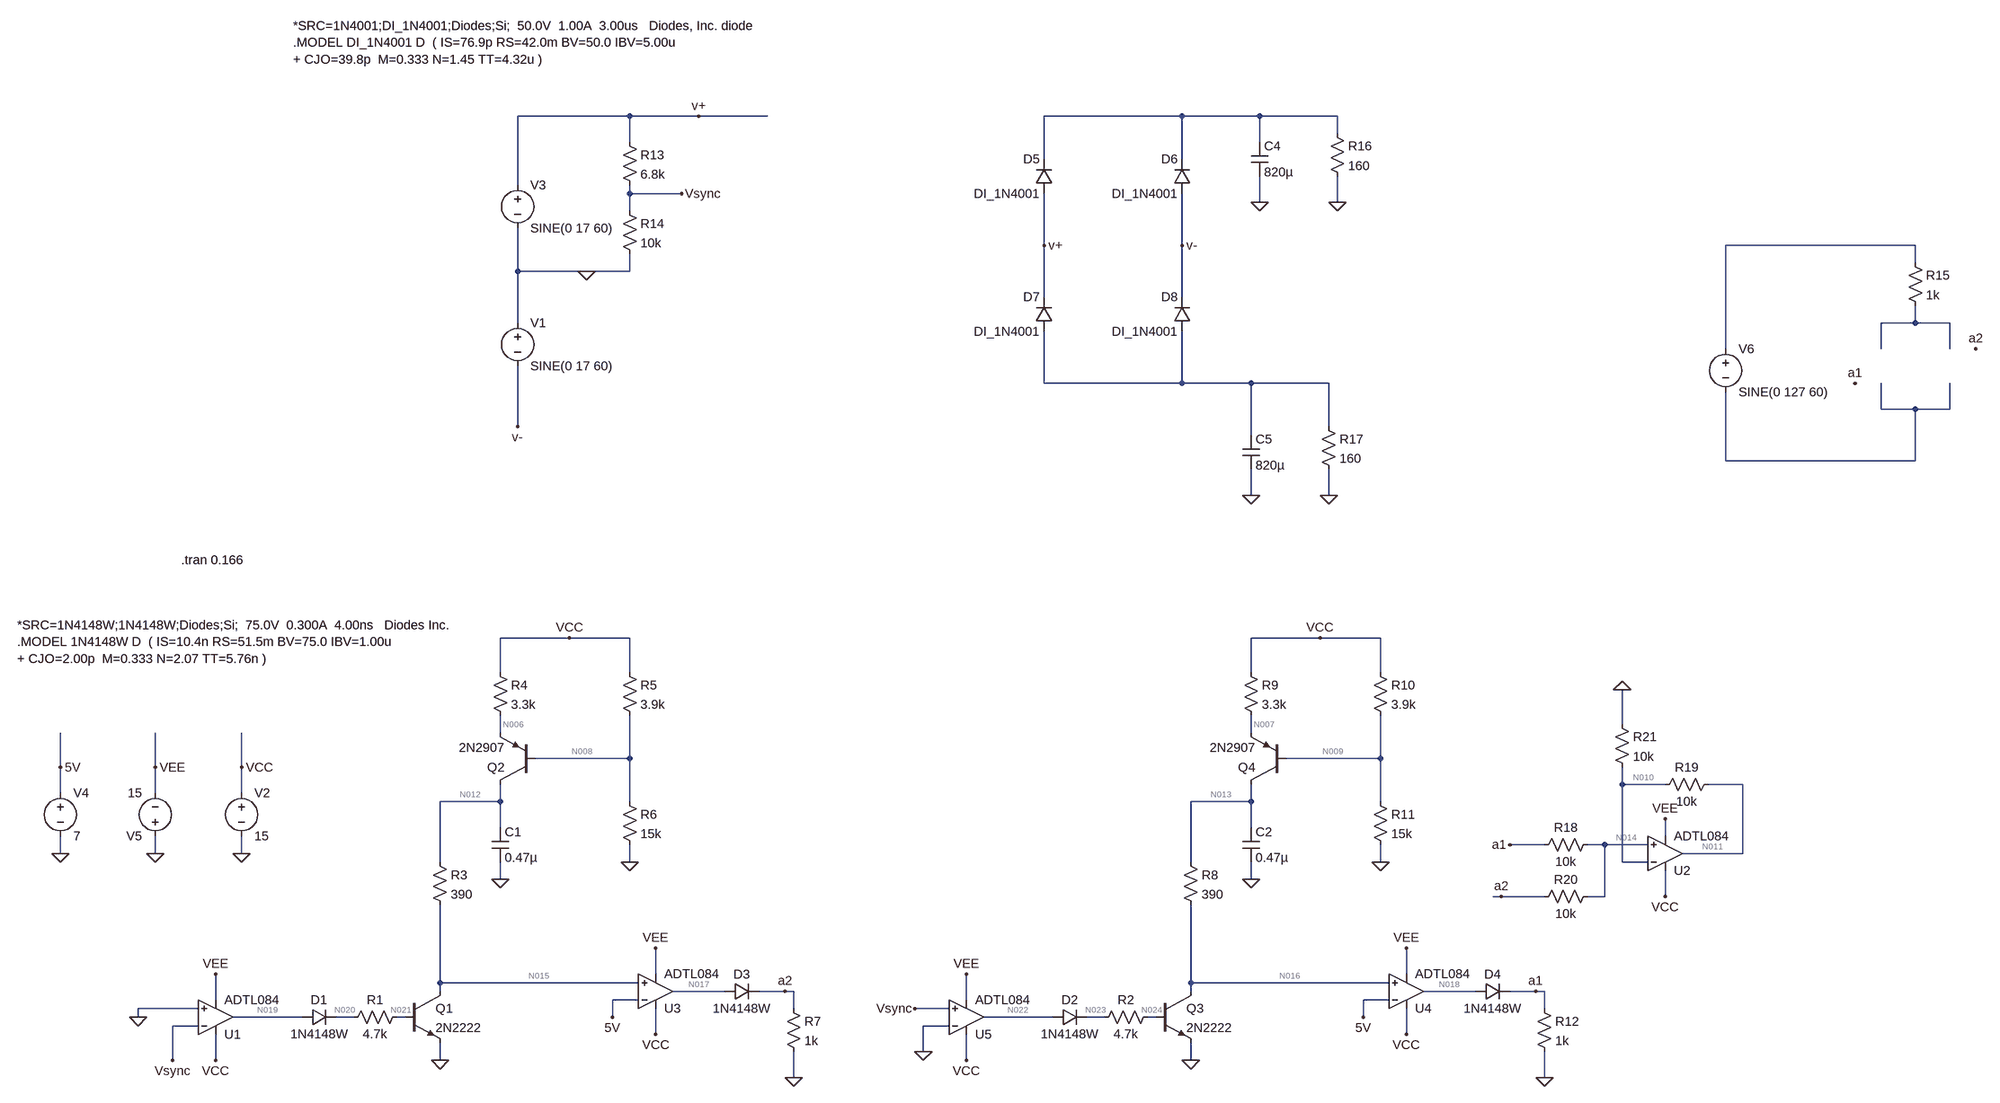
[diagram p0: schematic TDC_tiristores.asc]
TDC_tiristores.asc, the LTspice schematic file:
Version 4.1
SHEET 1 3504 1388
WIRE 944 -1568 736 -1568
WIRE 1072 -1568 944 -1568
WIRE 1200 -1568 1072 -1568
WIRE 2000 -1568 1744 -1568
WIRE 2144 -1568 2000 -1568
WIRE 2288 -1568 2144 -1568
WIRE 2288 -1536 2288 -1568
WIRE 944 -1520 944 -1568
WIRE 2144 -1520 2144 -1568
WIRE 1744 -1488 1744 -1568
WIRE 2000 -1488 2000 -1568
WIRE 736 -1440 736 -1568
WIRE 944 -1424 944 -1440
WIRE 1040 -1424 944 -1424
WIRE 2144 -1408 2144 -1456
WIRE 2288 -1408 2288 -1456
WIRE 944 -1392 944 -1424
WIRE 1744 -1328 1744 -1424
WIRE 2000 -1328 2000 -1424
WIRE 3360 -1328 3008 -1328
WIRE 3360 -1296 3360 -1328
WIRE 736 -1280 736 -1360
WIRE 864 -1280 736 -1280
WIRE 944 -1280 944 -1312
WIRE 944 -1280 864 -1280
WIRE 1744 -1232 1744 -1328
WIRE 2000 -1232 2000 -1328
WIRE 736 -1184 736 -1280
WIRE 3360 -1184 3360 -1216
WIRE 3360 -1184 3296 -1184
WIRE 3424 -1184 3360 -1184
WIRE 3008 -1136 3008 -1328
WIRE 3296 -1136 3296 -1184
WIRE 3424 -1136 3424 -1184
WIRE 1744 -1072 1744 -1168
WIRE 2000 -1072 2000 -1168
WIRE 2000 -1072 1744 -1072
WIRE 2128 -1072 2000 -1072
WIRE 2272 -1072 2128 -1072
WIRE 3296 -1024 3296 -1072
WIRE 3360 -1024 3296 -1024
WIRE 3424 -1024 3424 -1072
WIRE 3424 -1024 3360 -1024
WIRE 736 -992 736 -1104
WIRE 2272 -992 2272 -1072
WIRE 2128 -976 2128 -1072
WIRE 3008 -928 3008 -1056
WIRE 3360 -928 3360 -1024
WIRE 3360 -928 3008 -928
WIRE 2128 -864 2128 -912
WIRE 2272 -864 2272 -912
WIRE 832 -576 704 -576
WIRE 944 -576 832 -576
WIRE 2256 -576 2128 -576
WIRE 2368 -576 2256 -576
WIRE 704 -512 704 -576
WIRE 944 -512 944 -576
WIRE 2128 -512 2128 -576
WIRE 2368 -512 2368 -576
WIRE 2816 -416 2816 -480
WIRE 704 -400 704 -432
WIRE 2128 -400 2128 -432
WIRE 944 -352 944 -432
WIRE 944 -352 768 -352
WIRE 2368 -352 2368 -432
WIRE 2368 -352 2192 -352
WIRE -112 -336 -112 -400
WIRE 64 -336 64 -400
WIRE 224 -336 224 -400
WIRE 2816 -304 2816 -336
WIRE 2896 -304 2816 -304
WIRE 3040 -304 2976 -304
WIRE -112 -288 -112 -336
WIRE 64 -288 64 -336
WIRE 224 -288 224 -336
WIRE 704 -272 704 -304
WIRE 704 -272 592 -272
WIRE 944 -272 944 -352
WIRE 2128 -272 2128 -304
WIRE 2128 -272 2016 -272
WIRE 2368 -272 2368 -352
WIRE 704 -224 704 -272
WIRE 2128 -224 2128 -272
WIRE 2896 -208 2896 -240
WIRE 2672 -192 2608 -192
WIRE 2784 -192 2752 -192
WIRE 2864 -192 2784 -192
WIRE -112 -176 -112 -208
WIRE 64 -176 64 -208
WIRE 224 -176 224 -208
WIRE 3040 -176 3040 -304
WIRE 3040 -176 2928 -176
WIRE 592 -160 592 -272
WIRE 944 -160 944 -192
WIRE 2016 -160 2016 -272
WIRE 2368 -160 2368 -192
WIRE 2816 -160 2816 -304
WIRE 2864 -160 2816 -160
WIRE 704 -128 704 -160
WIRE 2128 -128 2128 -160
WIRE 2592 -96 2576 -96
WIRE 2672 -96 2592 -96
WIRE 2784 -96 2784 -192
WIRE 2784 -96 2752 -96
WIRE 2896 -96 2896 -144
WIRE 992 48 992 0
WIRE 2416 48 2416 0
WIRE 592 64 592 -80
WIRE 960 64 592 64
WIRE 2016 64 2016 -80
WIRE 2384 64 2016 64
WIRE 592 80 592 64
WIRE 1120 80 1024 80
WIRE 1232 80 1184 80
WIRE 1248 80 1232 80
WIRE 2016 80 2016 64
WIRE 2544 80 2448 80
WIRE 2656 80 2608 80
WIRE 2672 80 2656 80
WIRE 176 96 176 48
WIRE 960 96 912 96
WIRE 1600 96 1600 48
WIRE 2384 96 2336 96
WIRE 144 112 32 112
WIRE 1248 112 1248 80
WIRE 1568 112 1504 112
WIRE 2672 112 2672 80
WIRE 32 128 32 112
WIRE 336 128 208 128
WIRE 432 128 400 128
WIRE 528 128 512 128
WIRE 912 128 912 96
WIRE 1760 128 1632 128
WIRE 1856 128 1824 128
WIRE 1952 128 1936 128
WIRE 2336 128 2336 96
WIRE 144 144 96 144
WIRE 1568 144 1520 144
WIRE 992 160 992 112
WIRE 2416 160 2416 112
WIRE 1520 192 1520 144
WIRE 96 208 96 144
WIRE 176 208 176 160
WIRE 592 208 592 176
WIRE 1600 208 1600 160
WIRE 2016 208 2016 176
WIRE 1248 240 1248 192
WIRE 2672 240 2672 192
FLAG 224 -176 0
FLAG 64 -176 0
FLAG -112 -176 0
FLAG 224 -336 VCC
FLAG -112 -336 5V
FLAG 64 -336 VEE
FLAG 176 208 VCC
FLAG 32 128 0
FLAG 176 48 VEE
FLAG 592 208 0
FLAG 944 -160 0
FLAG 992 160 VCC
FLAG 992 0 VEE
FLAG 912 128 5V
FLAG 1248 240 0
FLAG 704 -128 0
FLAG 1600 208 VCC
FLAG 1600 48 VEE
FLAG 2016 208 0
FLAG 2368 -160 0
FLAG 2416 160 VCC
FLAG 2416 0 VEE
FLAG 2336 128 5V
FLAG 2672 240 0
FLAG 2128 -128 0
FLAG 1504 112 Vsync
FLAG 1520 192 0
FLAG 832 -576 VCC
FLAG 2256 -576 VCC
FLAG 1040 -1424 Vsync
FLAG 96 208 Vsync
FLAG 864 -1280 0
FLAG 1072 -1568 v+
FLAG 736 -992 v-
FLAG 2144 -1408 0
FLAG 2288 -1408 0
FLAG 2128 -864 0
FLAG 2272 -864 0
FLAG 1744 -1328 v+
FLAG 2000 -1328 v-
FLAG 2656 80 a1
FLAG 1232 80 a2
FLAG 3248 -1072 a1
FLAG 3472 -1136 a2
FLAG 2608 -192 a1
FLAG 2592 -96 a2
FLAG 2896 -240 VEE
FLAG 2896 -96 VCC
FLAG 2816 -480 0
SYMBOL OpAmps\\ADTL084 176 192 M180
SYMATTR InstName U1
SYMBOL voltage 224 -304 R0
WINDOW 123 0 0 Left 0
WINDOW 39 0 0 Left 0
SYMATTR InstName V2
SYMATTR Value 15
SYMBOL voltage -112 -304 R0
WINDOW 123 0 0 Left 0
WINDOW 39 0 0 Left 0
SYMATTR InstName V4
SYMATTR Value 7
SYMBOL diode 336 144 R270
WINDOW 0 32 32 VTop 2
WINDOW 3 0 32 VBottom 2
SYMATTR InstName D1
SYMATTR Value 1N4148W
SYMBOL res 528 112 R90
WINDOW 0 0 56 VBottom 2
WINDOW 3 32 56 VTop 2
SYMATTR InstName R1
SYMATTR Value 4.7k
SYMBOL npn 528 80 R0
SYMATTR InstName Q1
SYMATTR Value 2N2222
SYMBOL res 576 -176 R0
SYMATTR InstName R3
SYMATTR Value 390
SYMBOL pnp 768 -304 R180
SYMATTR InstName Q2
SYMATTR Value 2N2907
SYMBOL res 688 -528 R0
SYMATTR InstName R4
SYMATTR Value 3.3k
SYMBOL res 928 -528 R0
SYMATTR InstName R5
SYMATTR Value 3.9k
SYMBOL res 928 -288 R0
SYMATTR InstName R6
SYMATTR Value 15k
SYMBOL OpAmps\\ADTL084 992 144 M180
SYMATTR InstName U3
SYMBOL diode 1120 96 R270
WINDOW 0 32 32 VTop 2
WINDOW 3 0 32 VBottom 2
SYMATTR InstName D3
SYMATTR Value 1N4148W
SYMBOL res 1232 96 R0
SYMATTR InstName R7
SYMATTR Value 1k
SYMBOL cap 688 -224 R0
SYMATTR InstName C1
SYMATTR Value 0.47µ
SYMBOL diode 1760 144 R270
WINDOW 0 32 32 VTop 2
WINDOW 3 0 32 VBottom 2
SYMATTR InstName D2
SYMATTR Value 1N4148W
SYMBOL res 1952 112 R90
WINDOW 0 0 56 VBottom 2
WINDOW 3 32 56 VTop 2
SYMATTR InstName R2
SYMATTR Value 4.7k
SYMBOL npn 1952 80 R0
SYMATTR InstName Q3
SYMATTR Value 2N2222
SYMBOL res 2000 -176 R0
SYMATTR InstName R8
SYMATTR Value 390
SYMBOL pnp 2192 -304 R180
SYMATTR InstName Q4
SYMATTR Value 2N2907
SYMBOL res 2112 -528 R0
SYMATTR InstName R9
SYMATTR Value 3.3k
SYMBOL res 2352 -528 R0
SYMATTR InstName R10
SYMATTR Value 3.9k
SYMBOL res 2352 -288 R0
SYMATTR InstName R11
SYMATTR Value 15k
SYMBOL OpAmps\\ADTL084 2416 144 M180
SYMATTR InstName U4
SYMBOL diode 2544 96 R270
WINDOW 0 32 32 VTop 2
WINDOW 3 0 32 VBottom 2
SYMATTR InstName D4
SYMATTR Value 1N4148W
SYMBOL res 2656 96 R0
SYMATTR InstName R12
SYMATTR Value 1k
SYMBOL cap 2112 -224 R0
SYMATTR InstName C2
SYMATTR Value 0.47µ
SYMBOL OpAmps\\ADTL084 1600 192 M180
SYMATTR InstName U5
SYMBOL voltage 64 -192 R180
WINDOW 123 0 0 Left 0
WINDOW 39 0 0 Left 0
SYMATTR InstName V5
SYMATTR Value 15
SYMBOL voltage 736 -1456 R0
WINDOW 123 0 0 Left 0
WINDOW 39 0 0 Left 0
SYMATTR InstName V3
SYMATTR Value SINE(0 17 60)
SYMBOL res 928 -1536 R0
SYMATTR InstName R13
SYMATTR Value 6.8k
SYMBOL res 928 -1408 R0
SYMATTR InstName R14
SYMATTR Value 10k
SYMBOL voltage 736 -1200 R0
WINDOW 123 0 0 Left 0
WINDOW 39 0 0 Left 0
SYMATTR InstName V1
SYMATTR Value SINE(0 17 60)
SYMBOL diode 1760 -1424 R180
WINDOW 0 24 64 Left 2
WINDOW 3 24 0 Left 2
SYMATTR InstName D5
SYMATTR Value DI_1N4001
SYMBOL diode 2016 -1424 R180
WINDOW 0 24 64 Left 2
WINDOW 3 24 0 Left 2
SYMATTR InstName D6
SYMATTR Value DI_1N4001
SYMBOL diode 1760 -1168 R180
WINDOW 0 24 64 Left 2
WINDOW 3 24 0 Left 2
SYMATTR InstName D7
SYMATTR Value DI_1N4001
SYMBOL diode 2016 -1168 R180
WINDOW 0 24 64 Left 2
WINDOW 3 24 0 Left 2
SYMATTR InstName D8
SYMATTR Value DI_1N4001
SYMBOL cap 2128 -1520 R0
SYMATTR InstName C4
SYMATTR Value 820µ
SYMBOL res 2272 -1552 R0
SYMATTR InstName R16
SYMATTR Value 160
SYMBOL cap 2112 -976 R0
SYMATTR InstName C5
SYMATTR Value 820µ
SYMBOL res 2256 -1008 R0
SYMATTR InstName R17
SYMATTR Value 160
SYMBOL voltage 3008 -1152 R0
WINDOW 123 0 0 Left 0
WINDOW 39 0 0 Left 0
SYMATTR InstName V6
SYMATTR Value SINE(0 127 60)
SYMBOL res 3344 -1312 R0
SYMATTR InstName R15
SYMATTR Value 1k
SYMBOL OpAmps\\ADTL084 2896 -112 M180
SYMATTR InstName U2
SYMBOL res 2768 -208 R90
WINDOW 0 0 56 VBottom 2
WINDOW 3 32 56 VTop 2
SYMATTR InstName R18
SYMATTR Value 10k
SYMBOL res 2992 -320 R90
WINDOW 0 0 56 VBottom 2
WINDOW 3 32 56 VTop 2
SYMATTR InstName R19
SYMATTR Value 10k
SYMBOL res 2768 -112 R90
WINDOW 0 0 56 VBottom 2
WINDOW 3 32 56 VTop 2
SYMATTR InstName R20
SYMATTR Value 10k
SYMBOL res 2800 -432 R0
SYMATTR InstName R21
SYMATTR Value 10k
TEXT -192 -600 Left 2 !*SRC=1N4148W;1N4148W;Diodes;Si;  75.0V  0.300A  4.00ns   Diodes Inc. \n.MODEL 1N4148W D  ( IS=10.4n RS=51.5m BV=75.0 IBV=1.00u\n+ CJO=2.00p  M=0.333 N=2.07 TT=5.76n )
TEXT 112 -744 Left 2 !.tran 0.166
TEXT 320 -1736 Left 2 !*SRC=1N4001;DI_1N4001;Diodes;Si;  50.0V  1.00A  3.00us   Diodes, Inc. diode\n.MODEL DI_1N4001 D  ( IS=76.9p RS=42.0m BV=50.0 IBV=5.00u\n+ CJO=39.8p  M=0.333 N=1.45 TT=4.32u )

The netlist it stands for:
* TDC_tiristores.asc
X§U1 0 Vsync VCC VEE N019 ADTL084  ; pins In+ In- V+ V- OUT
V2 VCC 0 15
V4 5V 0 7
D1 N019 N020 1N4148W
R1 N021 N020 4.7k
Q1 N015 N021 0 0 2N2222
R3 N012 N015 390
Q2 N012 N008 N006 0 2N2907
R4 VCC N006 3.3k
R5 VCC N008 3.9k
R6 N008 0 15k
X§U3 N015 5V VCC VEE N017 ADTL084  ; pins In+ In- V+ V- OUT
D3 N017 a2 1N4148W
R7 a2 0 1k
C1 N012 0 0.47µ
D2 N022 N023 1N4148W
R2 N024 N023 4.7k
Q3 N016 N024 0 0 2N2222
R8 N013 N016 390
Q4 N013 N009 N007 0 2N2907
R9 VCC N007 3.3k
R10 VCC N009 3.9k
R11 N009 0 15k
X§U4 N016 5V VCC VEE N018 ADTL084  ; pins In+ In- V+ V- OUT
D4 N018 a1 1N4148W
R12 a1 0 1k
C2 N013 0 0.47µ
X§U5 Vsync 0 VCC VEE N022 ADTL084  ; pins In+ In- V+ V- OUT
V5 0 VEE 15
V3 v+ 0 SINE(0 17 60)
R13 v+ Vsync 6.8k
R14 Vsync 0 10k
V1 0 v- SINE(0 17 60)
D5 v+ N001 DI_1N4001
D6 v- N001 DI_1N4001
D7 N004 v+ DI_1N4001
D8 N004 v- DI_1N4001
C4 N001 0 820µ
R16 N001 0 160
C5 N004 0 820µ
R17 N004 0 160
V6 N002 N005 SINE(0 127 60)
R15 N002 N003 1k
X§U2 N014 N010 VCC VEE N011 ADTL084  ; pins In+ In- V+ V- OUT
R18 N014 a1 10k
R19 N011 N010 10k
R20 N014 a2 10k
R21 0 N010 10k
.model D D
.lib standard.dio
.model NPN NPN
.model PNP PNP
.lib standard.bjt
*SRC=1N4148W;1N4148W;Diodes;Si;  75.0V  0.300A  4.00ns   Diodes Inc.
.MODEL 1N4148W D  ( IS=10.4n RS=51.5m BV=75.0 IBV=1.00u
+ CJO=2.00p  M=0.333 N=2.07 TT=5.76n )
.tran 0.166
*SRC=1N4001;DI_1N4001;Diodes;Si;  50.0V  1.00A  3.00us   Diodes, Inc. diode
.MODEL DI_1N4001 D  ( IS=76.9p RS=42.0m BV=50.0 IBV=5.00u
+ CJO=39.8p  M=0.333 N=1.45 TT=4.32u )
.lib ADTL084.lib
.backanno
.end

* Results of the author's LTspice run, read from the files saved beside the schematic
* Operating Point, zero values left out:
*   V(5v) = 7 V
*   V(a1) = 12.61 V
*   V(a2) = 12.61 V
*   V(n006) = 13.75 V
*   V(n007) = 13.75 V
*   V(n008) = 13.08 V
*   V(n009) = 13.08 V
*   V(n010) = 7.274 V
*   V(n011) = 14.55 V
*   V(n012) = 13.74 V
*   V(n013) = 13.74 V
*   V(n014) = 12.61 V
*   V(n015) = 13.74 V
*   V(n016) = 13.74 V
*   V(n017) = 13.36 V
*   V(n018) = 13.36 V
*   V(n019) = 10.94 mV
*   V(n020) = 11.01 mV
*   V(n021) = 11.01 mV
*   V(n022) = -10.94 mV
*   V(n023) = -10.87 mV
*   V(n024) = -10.87 mV
*   V(vcc) = 15 V
*   V(vee) = -15 V
*   V(vsync) = -16.19 nV
*   I(D1) = -13.72 pA
*   I(D2) = -13.77 pA
*   I(D3) = 12.61 mA
*   I(D4) = 12.61 mA
*   I(R1) = 13.72 pA
*   I(R10) = 492.6 µA
*   I(R11) = 871.9 µA
*   I(R12) = 12.61 mA
*   I(R13) = 2.381 pA
*   I(R14) = -1.619 pA
*   I(R18) = -51.44 pA
*   I(R19) = 727.4 µA
*   I(R2) = 13.77 pA
*   I(R20) = -51.44 pA
*   I(R21) = -727.4 µA
*   I(R3) = 125.7 pA
*   I(R4) = 379.3 µA
*   I(R5) = 492.6 µA
*   I(R6) = 871.9 µA
*   I(R7) = 12.61 mA
*   I(R8) = 125.7 pA
*   I(R9) = 379.3 µA
*   I(V2) = -51.88 mA
*   I(V3) = -2.381 pA
*   I(V4) = -116 pA
*   I(V5) = -24.45 mA
*   Ib(Q1) = -13.72 pA
*   Ib(Q2) = -379.3 µA
*   Ib(Q3) = -13.77 pA
*   Ib(Q4) = -379.3 µA
*   Ic(Q1) = 13.74 pA
*   Ic(Q2) = -125.7 pA
*   Ic(Q3) = 13.75 pA
*   Ic(Q4) = -125.7 pA
*   Ie(Q2) = 379.3 µA
*   Ie(Q4) = 379.3 µA
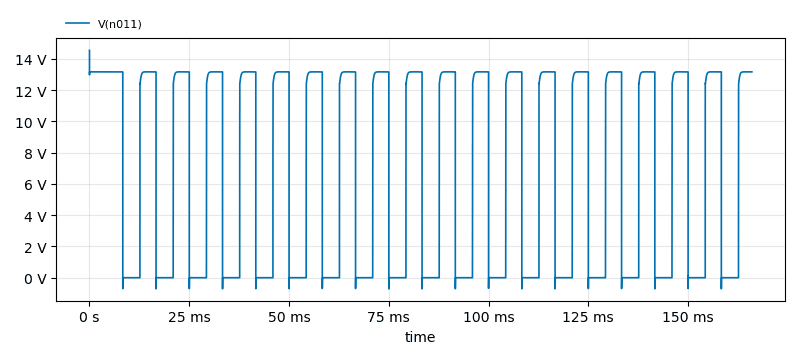
[diagram p1: Transient Analysis of TDC_tiristores.asc, plotted from the saved traces]
* Transient Analysis, 1 run:
*   V(n011): min -709 mV, max 14.55 V, average 6.665 V, rms 9.352 V, last 13.17 V